# EAGLE design pwr_ctl (EAGLE 7.5.0)
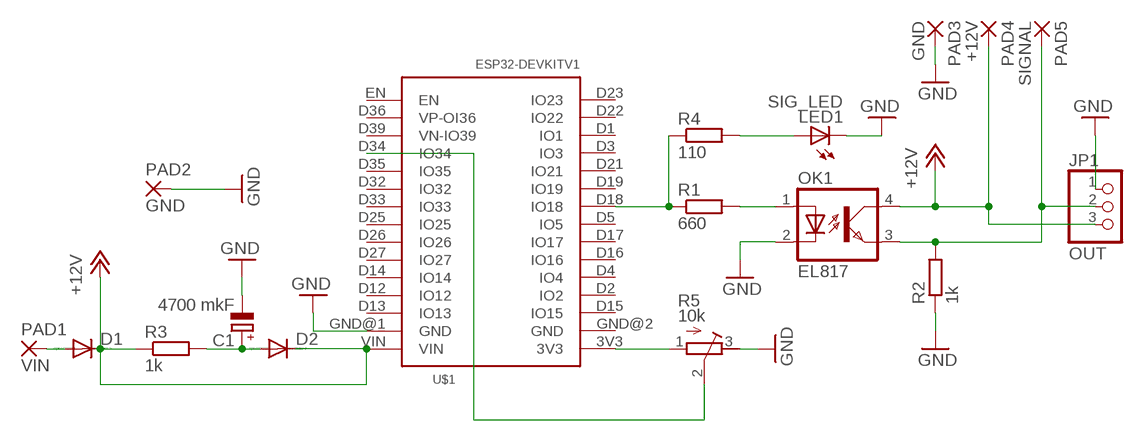
[diagram p0: schematic, sheet 1]

## Parts
C1  4700 mkF  CPOL-EUE7.5-18  [E7,5-18]
D1  CGRM4007-G  [SOD-123_MINI-SMA]
D2  CGRM4007-G  [SOD-123_MINI-SMA]
JP1  OUT  PINHD-1X3  [1X03]
LED1  SIG_LED  LEDSML0805  [SML0805]
OK1  EL817  LTV816S  [SMD4]
PAD1  VIN  SMD5  [SMD2,54-5,08]
PAD2  GND  SMD5  [SMD2,54-5,08]
PAD3  GND  SMD5  [SMD2,54-5,08]
PAD4  +12V  SMD5  [SMD2,54-5,08]
PAD5  SIGNAL  SMD5  [SMD2,54-5,08]
R1  660  R-EU_R0805  [R0805]
R2  1k  R-EU_R0805  [R0805]
R3  1k  R-EU_R0805  [R0805]
R4  110  R-EU_R0805  [R0805]
R5  10k  R-TRIMM3296W  [RTRIM3296W]
U$1  ESP32DEVKITV1  [ESP32-DEVKITV1]

## Nets
+12V: D1.C D2.C JP1.3 OK1.4(COL) PAD4.1(P) R3.1 U$1.VIN
GND: C1.- JP1.1 LED1.C OK1.2(C) PAD2.1(P) PAD3.1(P) R2.1 R5.3(E) U$1.GND@1(GND)
N$1: R1.1 R4.1 U$1.D18(IO18)
N$2: OK1.1(A) R1.2
N$3: R5.1(A) U$1.3V3
N$4: C1.+ D2.A R3.2
N$5: LED1.A R4.2
N$6: D1.A PAD1.1(P)
N$7: JP1.2 OK1.3(EMIT) PAD5.1(P) R2.2
N$8: R5.2(S) U$1.D34(IO34)
Unconnected: U$1.D1(IO1) U$1.D2(IO2) U$1.D3(IO3) U$1.D4(IO4) U$1.D5(IO5) U$1.D12(IO12) U$1.D13(IO13) U$1.D14(IO14) U$1.D15(IO15) U$1.D16(IO16) U$1.D17(IO17) U$1.D19(IO19) U$1.D21(IO21) U$1.D22(IO22) U$1.D23(IO23) U$1.D25(IO25) U$1.D26(IO26) U$1.D27(IO27) U$1.D32(IO32) U$1.D33(IO33) U$1.D35(IO35) U$1.D36(VP-OI36) U$1.D39(VN-IO39) U$1.EN U$1.GND@2(GND)

## Library data of the parts
C1 = resistor:CPOL-EU: POLARIZED CAPACITOR, European symbol
D1 D2 = diode:CGRM400*-G: Molded plasitc,JEDEC SOD-123/Mini SMA Source: Comchip CGRM4001-G.pdf
JP1 = pinhead:PINHD-1X3: PIN HEADER
LED1 = led:LED: LED OSRAM: - CHIPLED LG R971, LG N971, LY N971, LG Q971, LY Q971, LO R971, LY R971 LH N974, LH R974 LS Q976, LO Q976, LY Q976 LO Q996 - Hyper CHIPLED LW Q18S LB Q993, LB Q99A, LB R99A - SideLED LS A670, LO A670, LY A670, LG A670, LP A670 LB A673, LV A673, LT A673, LW A673 LH A674 LY A675 LS A676, LA A676, LO A676, LY A676, LW A676 LS A679, LY A679, LG A679 - Hyper Micro SIDELED® LS Y876, LA Y876, LO Y876, LY Y876 LT Y87S - SmartLED LW L88C, LW L88S LB L89C, LB L89S, LG L890 LS L89K, LO L89K, LY L89K LS L896, LA L896, LO L896, LY L896 - TOPLED LS T670, LO T670, LY T670, LG T670, LP T670 LSG T670, LSP T670, LSY T670, LOP T670, LYG T670 LG T671, LOG T671, LSG T671 LB T673, LV T673, LT T673, LW T673 LH T674 LS T676, LA T676, LO T676, LY T676, LB T676, LH T676, LSB T676, LW T676 LB T67C, LV T67C, LT T67C, LS T67K, LO T67K, LY T67K, LW E67C LS E67B, LA E67B, LO E67B, LY E67B, LB E67C, LV E67C, LT E67C LW T67C LS T679, LY T679, LG T679 LS T770, LO T770, LY T770, LG T770, LP T770 LB T773, LV T773, LT T773, LW T773 LH T774 LS E675, LA E675, LY E675, LS T675 LS T776, LA T776, LO T776, LY T776, LB T776 LHGB T686 LT T68C, LB T68C - Hyper Mini TOPLED® LB M676 - Mini TOPLED Santana® LG M470 LS M47K, LO M47K, LY M47K Source: http://www.osram.convergy.de LUXEON: - LUMILED® LXK2-PW12-R00, LXK2-PW12-S00, LXK2-PW14-U00, LXK2-PW14-V00 LXK2-PM12-R00, LXK2-PM12-S00, LXK2-PM14-U00 LXK2-PE12-Q00, LXK2-PE12-R00, LXK2-PE12-S00, LXK2-PE14-T00, LXK2-PE14-U00 LXK2-PB12-K00, LXK2-PB12-L00, LXK2-PB12-M00, LXK2-PB14-N00, LXK2-PB14-P00, LXK2-PB14-Q00 LXK2-PR12-L00, LXK2-PR12-M00, LXK2-PR14-Q00, LXK2-PR14-R00 LXK2-PD12-Q00, LXK2-PD12-R00, LXK2-PD12-S00 LXK2-PH12-R00, LXK2-PH12-S00 LXK2-PL12-P00, LXK2-PL12-Q00, LXK2-PL12-R00 Source: www.luxeon.com KINGBRIGHT: KA-3528ASYC Source: www.kingbright.com
OK1 = optocoupler:LTV816: OPTO COUPLER Source: LITEON, LTV816.pdf; OC_FARNELL: unknown; OC_NEWARK: unknown
PAD1-PAD5 = wirepad:SMD5: SMD PAD
R1-R4 = resistor:R-EU_: RESISTOR, European symbol
R5 = rcl:R-TRIMM: Trimm resistor
U$1 = ESP32-DEVKITV1:ESP32DEVKITV1

## Board
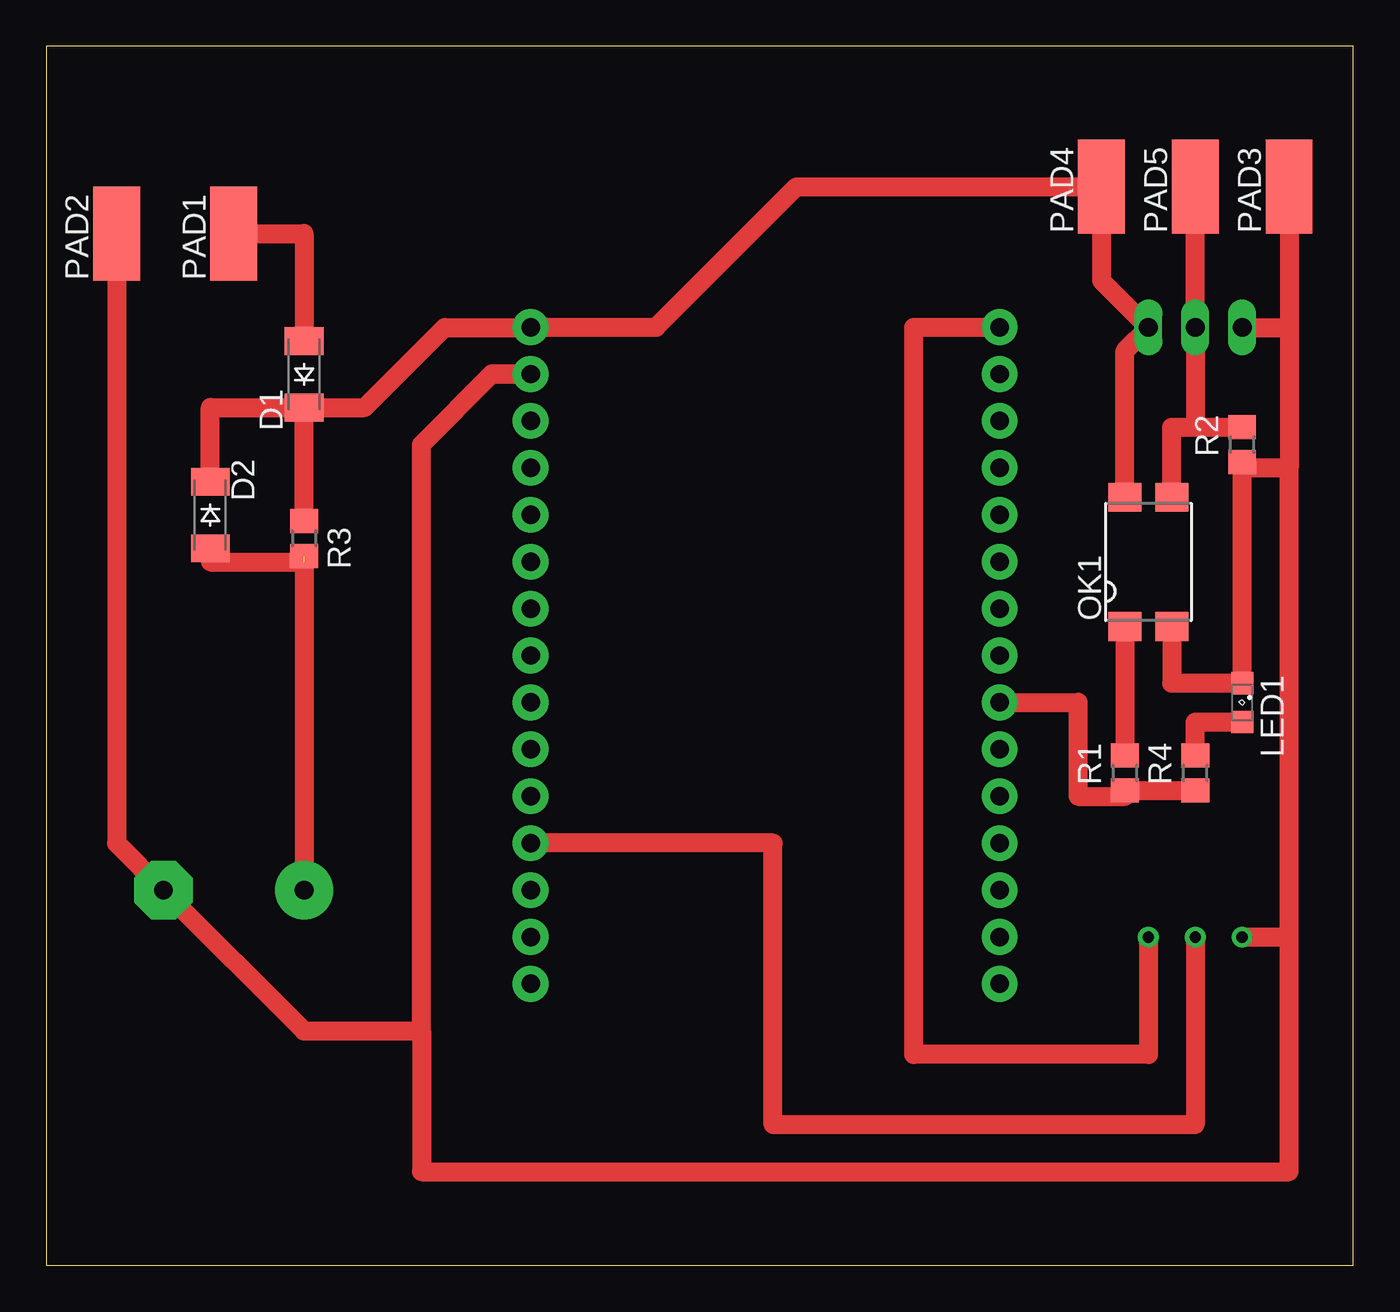
[diagram p1: board, top side]
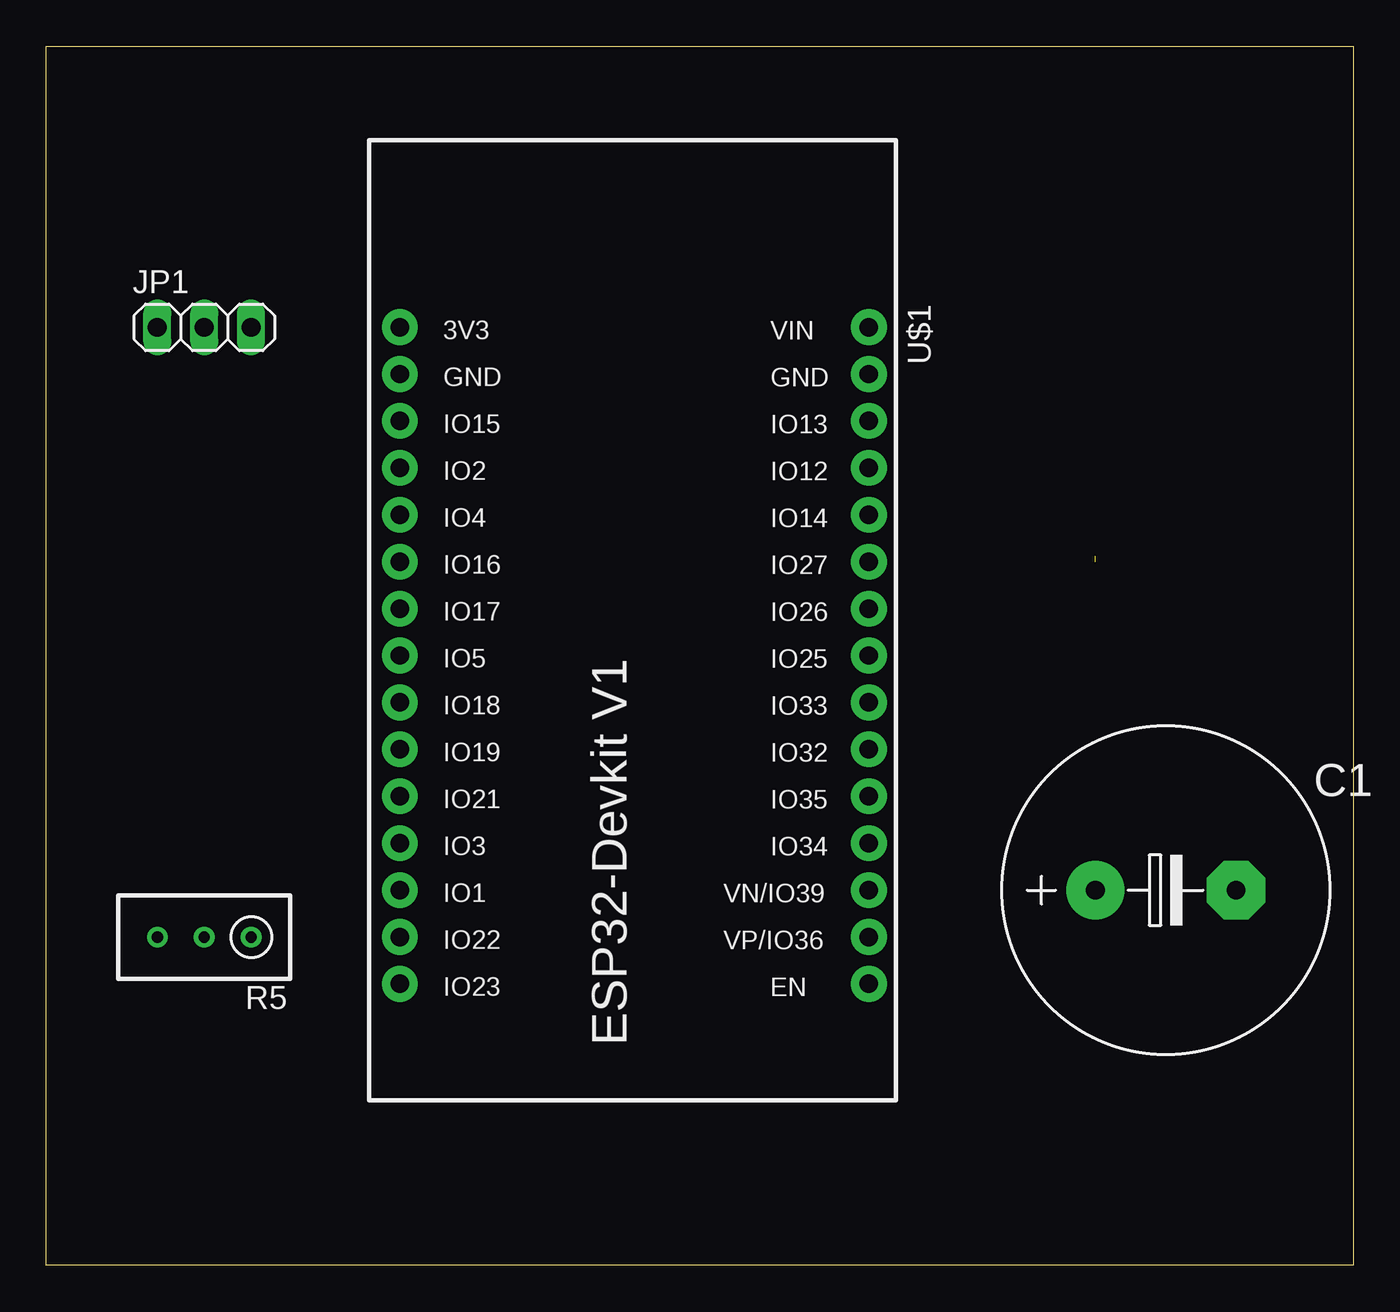
[diagram p2: board, bottom side, seen from below]

Size 70.79 x 66.03 mm. Coordinates in mm from the lower left corner, seen from the top.
Outline: 0,0 70.79,0 70.79,66.03 0,66.03 0,0
Copper layers (1*16): Top 0.035mm / dielectric 1.5mm / Bottom 0.035mm
Design rules "default": minimum track width 10mil, minimum drill 24mil, track to track 8mil, track to pad 8mil, pad to pad 8mil, via to via 8mil, smd to smd 8mil, copper to edge 40mil, drill to drill 8mil, minimum pad ring 10mil, minimum via ring 8mil, stop-mask expansion 4mil, vias tented up to drill 0mil, thermal gap 10mil

### Footprints (pad centres in the part's own frame; a part is rotated, then mirrored left to right if it is on the bottom)
E7,5-18 = drill 1.016 pad 3.15: + -3.81,0 | drill 1.016 pad 3.15 octagon: - 3.81,0
SOD-123_MINI-SMA = smd 1.5 x 2.1: A 1.8,0; C -1.8,0
1X03 = drill 1.016 long: 1 -2.54,0; 2 0,0; 3 2.54,0
SML0805 = smd 1.2 x 1.2: A 1.05,0; C -1.05,0
SMD4 = smd 1.78 x 1.55: 1 -1.27,-3.5; 2 1.27,-3.5; 3 1.27,3.5; 4 -1.27,3.5
SMD2,54-5,08 = smd 2.54 x 5.08: 1 0,0
R0805 = smd 1.3 x 1.5: 1 -0.95,0; 2 0.95,0
RTRIM3296W = drill 0.61: 1 0,-2.54; 2 0,0; 3 0,2.54
ESP32-DEVKITV1 = drill 1 pad 1.93: 3V3 -16.52,-12.27; D1 13.96,-12.27; D2 -8.9,-12.27; D3 11.42,-12.27; D4 -6.36,-12.27; D5 1.26,-12.27; D12 -8.9,13.135; D13 -11.44,13.135; D14 -6.36,13.135; D15 -11.44,-12.27; D16 -3.82,-12.27; D17 -1.28,-12.27; D18 3.8,-12.27; D19 6.34,-12.27; D21 8.88,-12.27; D22 16.5,-12.27; D23 19.04,-12.27; D25 1.26,13.135; D26 -1.28,13.135; D27 -3.82,13.135; D32 6.34,13.135; D33 3.8,13.135; D34 11.42,13.135; D35 8.88,13.135; D36 16.5,13.135; D39 13.96,13.135; EN 19.04,13.135; GND@1 -13.98,13.135; GND@2 -13.98,-12.27; VIN -16.52,13.135

### Placement (x,y rotation side)
C1  10.16,20.32 0 bottom
D1  13.97,48.26 90 top
D2  8.89,40.64 270 top
JP1  62.23,50.8 0 bottom
LED1  64.77,30.48 270 top
OK1  59.69,38.1 0 top
PAD1  10.16,55.88 0 top
PAD2  3.81,55.88 0 top
PAD3  67.31,58.42 0 top
PAD4  57.15,58.42 0 top
PAD5  62.23,58.42 0 top
R1  58.42,26.67 90 top
R2  64.77,44.45 90 top
R3  13.97,39.37 270 top
R4  62.23,26.67 90 top
R5  62.23,17.78 90 bottom
U$1  39.37,34.29 270 bottom

### Tracks (layer width: path | path; a pad name or v marks a point on that pad's centre or on a via)
+12V
  Top 1.016: D1.C 17.25,46.46 21.59,50.8 U$1.VIN 33.03,50.81 40.64,58.42 PAD4.1 57.15,53.34 JP1.3 58.42,49.53 OK1.4 | R3.1 D1.C | D2.C 8.89,46.46 D1.C
GND
  Top 1.016: PAD2.1 3.81,22.86 C1.- 13.97,12.7 20.32,12.7 | 20.32,12.7 20.32,44.45 24.13,48.26 | 24.13,48.26 U$1.GND@1 24.14,48.27 24.13,48.26 | OK1.2 60.96,31.53 LED1.C 64.77,43.18 | 64.77,43.18 R2.1 | PAD3.1 67.31,50.8 | JP1.1 67.31,50.8 | 67.31,50.8 67.31,43.18 | 67.31,43.18 64.77,43.18 | R5.3 67.31,17.78 | 67.31,17.78 67.31,43.18 | 20.32,12.7 20.32,5.08 67.31,5.08 67.31,17.78
N$1
  Top 1.016: U$1.D18 55.88,30.49 55.88,25.4 58.42,25.4 R1.1 R4.1
N$2
  Top 1.016: OK1.1 R1.2
N$3
  Top 1.016: R5.1 59.69,11.43 46.99,11.43 46.99,50.81 U$1.3V3
N$4  (1 unrouted)
  Top 1.016: D2.A 8.89,38.1 13.97,38.1 C1.+
N$5
  Top 1.016: R4.2 62.23,29.43 LED1.A
N$6
  Top 1.016: PAD1.1 13.97,55.88 D1.A
N$7
  Top 1.016: PAD5.1 JP1.2 62.23,45.4 | OK1.3 60.96,45.4 62.23,45.4 | 62.23,45.4 R2.2
N$8
  Top 1.016: R5.2 62.23,7.62 39.37,7.62 39.37,22.87 U$1.D34